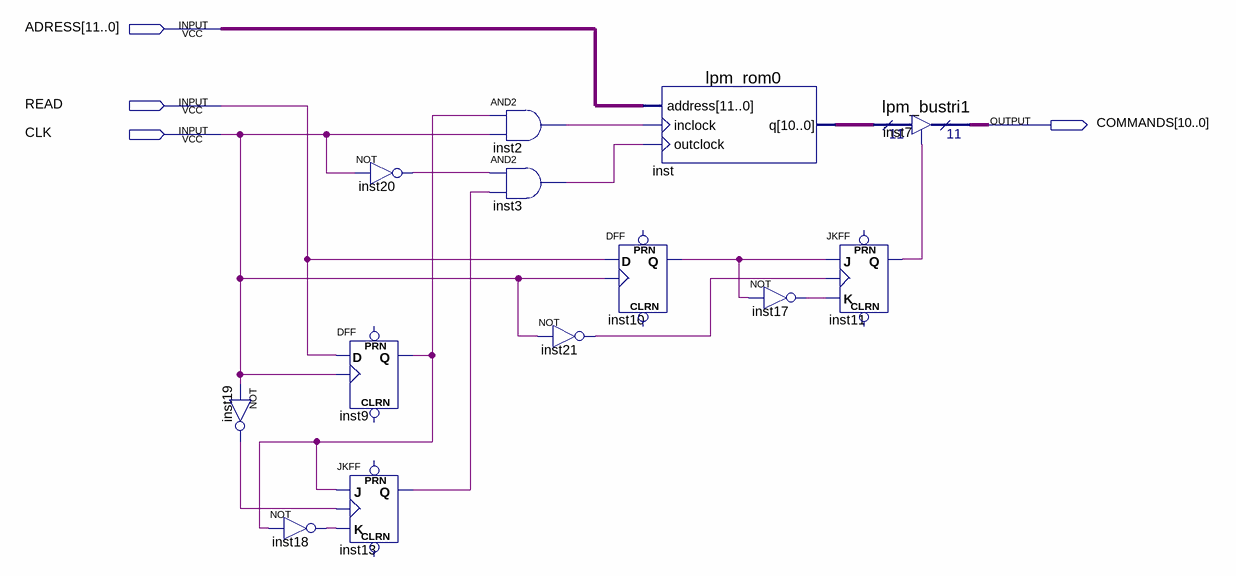
[diagram p0: schematic sheet]
// Quartus schematic ROM.bdf as structural Verilog: 13 symbols, 4 pins
module ROM (
  input  [11:0] ADRESS,
  input  READ,
  input  CLK,
  output [10:0] COMMANDS
);

  wire inst2_out, inst3_out, inst9_q, inst10_q, inst11_q, inst13_q, inst17_out, inst18_out, inst19_out,
       inst20_out, inst21_out;
  wire [10:0] inst_q;

  not inst19 (inst19_out, CLK);
  not inst18 (inst18_out, inst9_q);
  not inst20 (inst20_out, CLK);
  DFF inst9 (.CLK(CLK), .D(READ), .Q(inst9_q));  // open: CLRN, PRN
  JKFF inst13 (.K(inst18_out), .J(inst9_q), .CLK(inst19_out), .Q(inst13_q));  // open: PRN, CLRN
  and inst2 (inst2_out, inst9_q, CLK);
  and inst3 (inst3_out, inst20_out, inst13_q);
  DFF inst10 (.CLK(CLK), .D(READ), .Q(inst10_q));  // open: CLRN, PRN
  not inst21 (inst21_out, CLK);
  lpm_rom0 inst (.address(ADRESS), .inclock(inst2_out), .outclock(inst3_out), .q(inst_q));
  not inst17 (inst17_out, inst10_q);
  JKFF inst11 (.K(inst17_out), .J(inst10_q), .CLK(inst21_out), .Q(inst11_q));  // open: PRN, CLRN
  lpm_bustri1 inst7 (.enabledt(inst11_q), .data(inst_q), .tridata(COMMANDS));
endmodule
